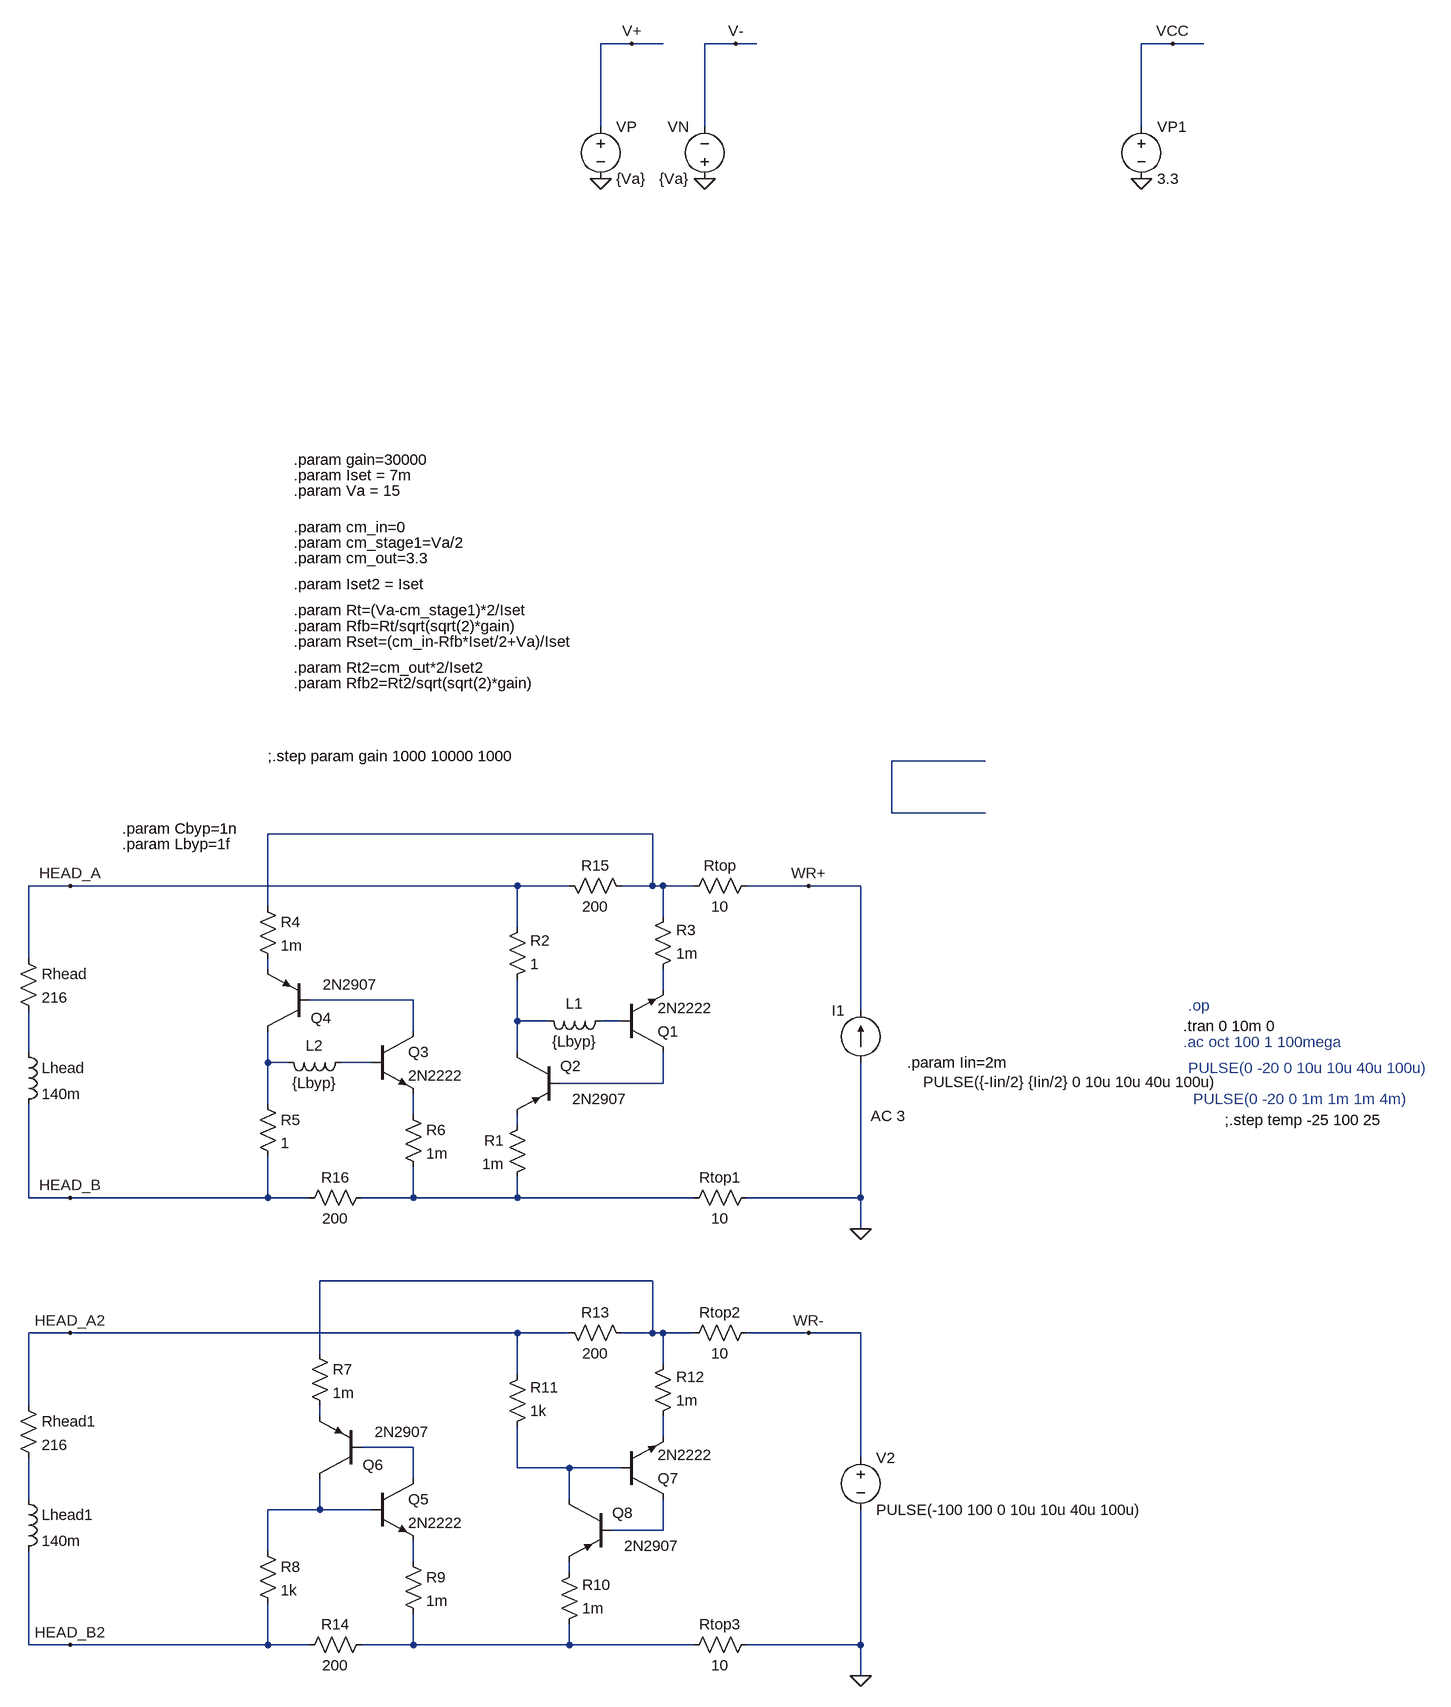
[diagram p0: schematic tape_record_amp1.asc]
tape_record_amp1.asc, the LTspice schematic file:
Version 4.1
SHEET 1 4868 2048
WIRE -224 -1328 -272 -1328
WIRE -176 -1328 -224 -1328
WIRE -64 -1328 -112 -1328
WIRE -32 -1328 -64 -1328
WIRE 608 -1328 560 -1328
WIRE 656 -1328 608 -1328
WIRE -272 -1200 -272 -1328
WIRE -112 -1200 -112 -1328
WIRE 560 -1200 560 -1328
WIRE 320 -224 176 -224
WIRE 176 -144 176 -224
WIRE 320 -144 176 -144
WIRE -192 -112 -784 -112
WIRE -1088 -32 -1152 -32
WIRE -400 -32 -1088 -32
WIRE -320 -32 -400 -32
WIRE -192 -32 -192 -112
WIRE -192 -32 -240 -32
WIRE -176 -32 -192 -32
WIRE -128 -32 -176 -32
WIRE 48 -32 -48 -32
WIRE 128 -32 48 -32
WIRE -784 0 -784 -112
WIRE -176 16 -176 -32
WIRE -400 32 -400 -32
WIRE -1152 80 -1152 -32
WIRE -784 96 -784 80
WIRE -176 128 -176 96
WIRE -560 144 -720 144
WIRE 128 160 128 -32
WIRE -400 176 -400 112
WIRE -352 176 -400 176
WIRE -240 176 -272 176
WIRE -560 192 -560 144
WIRE -1152 224 -1152 160
WIRE -400 224 -400 176
WIRE -784 240 -784 192
WIRE -752 240 -784 240
WIRE -624 240 -672 240
WIRE -176 272 -176 224
WIRE -176 272 -336 272
WIRE -784 304 -784 240
WIRE -560 320 -560 288
WIRE -400 336 -400 320
WIRE -1152 448 -1152 304
WIRE -1088 448 -1152 448
WIRE -784 448 -784 384
WIRE -784 448 -1088 448
WIRE -720 448 -784 448
WIRE -560 448 -560 400
WIRE -560 448 -640 448
WIRE -400 448 -400 416
WIRE -400 448 -560 448
WIRE -128 448 -400 448
WIRE 128 448 128 240
WIRE 128 448 -48 448
WIRE 128 496 128 448
WIRE -192 576 -704 576
WIRE -1088 656 -1152 656
WIRE -400 656 -1088 656
WIRE -320 656 -400 656
WIRE -192 656 -192 576
WIRE -192 656 -240 656
WIRE -176 656 -192 656
WIRE -128 656 -176 656
WIRE 48 656 -48 656
WIRE 128 656 48 656
WIRE -704 688 -704 576
WIRE -176 704 -176 656
WIRE -400 720 -400 656
WIRE -1152 768 -1152 656
WIRE -704 784 -704 768
WIRE -176 816 -176 784
WIRE -560 832 -640 832
WIRE 128 848 128 656
WIRE -400 864 -400 800
WIRE -320 864 -400 864
WIRE -240 864 -320 864
WIRE -560 880 -560 832
WIRE -1152 912 -1152 848
WIRE -320 912 -320 864
WIRE -704 928 -704 880
WIRE -704 928 -784 928
WIRE -624 928 -704 928
WIRE -176 960 -176 912
WIRE -176 960 -256 960
WIRE -784 992 -784 928
WIRE -560 1008 -560 976
WIRE -320 1024 -320 1008
WIRE -1152 1136 -1152 992
WIRE -1088 1136 -1152 1136
WIRE -784 1136 -784 1072
WIRE -784 1136 -1088 1136
WIRE -720 1136 -784 1136
WIRE -560 1136 -560 1088
WIRE -560 1136 -640 1136
WIRE -320 1136 -320 1104
WIRE -320 1136 -560 1136
WIRE -128 1136 -320 1136
WIRE 128 1136 128 928
WIRE 128 1136 -48 1136
WIRE 128 1184 128 1136
FLAG -272 -1120 0
FLAG -112 -1120 0
FLAG -224 -1328 V+
FLAG -64 -1328 V-
FLAG 560 -1120 0
FLAG 608 -1328 VCC
FLAG -1088 -32 HEAD_A
FLAG -1088 448 HEAD_B
FLAG 48 -32 WR+
FLAG 128 496 0
FLAG -1088 656 HEAD_A2
FLAG -1088 1136 HEAD_B2
FLAG 48 656 WR-
FLAG 128 1184 0
SYMBOL voltage -272 -1216 R0
SYMATTR InstName VP
SYMATTR Value {Va}
SYMBOL voltage -112 -1104 R180
WINDOW 0 24 96 Left 2
WINDOW 3 24 16 Left 2
SYMATTR InstName VN
SYMATTR Value {Va}
SYMBOL voltage 560 -1216 R0
SYMATTR InstName VP1
SYMATTR Value 3.3
SYMBOL current 128 240 R180
WINDOW 0 24 80 Left 2
WINDOW 3 -553 -30 Left 2
WINDOW 123 -69 -82 Left 2
WINDOW 39 0 0 Left 0
SYMATTR InstName I1
SYMATTR Value PULSE({-Iin/2} {Iin/2} 0 10u 10u 40u 100u)
SYMATTR Value2 AC 3
SYMBOL ind -1168 208 R0
SYMATTR InstName Lhead
SYMATTR Value 140m
SYMATTR SpiceLine Rser=1m
SYMBOL res -1168 64 R0
SYMATTR InstName Rhead
SYMATTR Value 216
SYMBOL res -32 -48 R90
WINDOW 0 0 56 VBottom 2
WINDOW 3 32 56 VTop 2
SYMATTR InstName Rtop
SYMATTR Value 10
SYMBOL res -144 464 R270
WINDOW 0 32 56 VTop 2
WINDOW 3 0 56 VBottom 2
SYMATTR InstName Rtop1
SYMATTR Value 10
SYMBOL ind -1168 896 R0
SYMATTR InstName Lhead1
SYMATTR Value 140m
SYMATTR SpiceLine Rser=1m
SYMBOL res -1168 752 R0
SYMATTR InstName Rhead1
SYMATTR Value 216
SYMBOL res -32 640 R90
WINDOW 0 0 56 VBottom 2
WINDOW 3 32 56 VTop 2
SYMATTR InstName Rtop2
SYMATTR Value 10
SYMBOL voltage 128 832 R0
WINDOW 123 0 0 Left 0
WINDOW 39 0 0 Left 0
SYMATTR InstName V2
SYMATTR Value PULSE(-100 100 0 10u 10u 40u 100u)
SYMBOL npn -240 912 M180
SYMATTR InstName Q7
SYMATTR Value 2N2222
SYMBOL pnp -256 912 M0
WINDOW 0 -34 21 Left 2
WINDOW 3 -105 72 Left 2
SYMATTR InstName Q8
SYMATTR Value 2N2907
SYMBOL res -336 1120 M180
WINDOW 0 36 76 Left 2
WINDOW 3 36 40 Left 2
SYMATTR InstName R10
SYMATTR Value 1m
SYMBOL res -416 816 M180
WINDOW 0 36 76 Left 2
WINDOW 3 36 40 Left 2
SYMATTR InstName R11
SYMATTR Value 1k
SYMBOL res -192 800 M180
WINDOW 0 36 76 Left 2
WINDOW 3 36 40 Left 2
SYMATTR InstName R12
SYMATTR Value 1m
SYMBOL res -32 1120 R90
WINDOW 0 0 56 VBottom 2
WINDOW 3 32 56 VTop 2
SYMATTR InstName Rtop3
SYMATTR Value 10
SYMBOL npn -624 880 R0
SYMATTR InstName Q5
SYMATTR Value 2N2222
SYMBOL pnp -640 880 R180
WINDOW 0 -34 21 Left 2
WINDOW 3 -105 72 Left 2
SYMATTR InstName Q6
SYMATTR Value 2N2907
SYMBOL res -720 672 R0
SYMATTR InstName R7
SYMATTR Value 1m
SYMBOL res -800 976 R0
SYMATTR InstName R8
SYMATTR Value 1k
SYMBOL res -576 992 R0
SYMATTR InstName R9
SYMATTR Value 1m
SYMBOL res -336 640 M90
WINDOW 0 0 56 VBottom 2
WINDOW 3 32 56 VTop 2
SYMATTR InstName R13
SYMATTR Value 200
SYMBOL res -624 1120 R90
WINDOW 0 0 56 VBottom 2
WINDOW 3 32 56 VTop 2
SYMATTR InstName R14
SYMATTR Value 200
SYMBOL npn -240 224 M180
SYMATTR InstName Q1
SYMATTR Value 2N2222
SYMBOL pnp -336 224 M0
WINDOW 0 -34 21 Left 2
WINDOW 3 -105 72 Left 2
SYMATTR InstName Q2
SYMATTR Value 2N2907
SYMBOL res -384 320 M0
SYMATTR InstName R1
SYMATTR Value 1m
SYMBOL res -416 128 M180
WINDOW 0 36 76 Left 2
WINDOW 3 36 40 Left 2
SYMATTR InstName R2
SYMATTR Value 1
SYMBOL res -192 112 M180
WINDOW 0 36 76 Left 2
WINDOW 3 36 40 Left 2
SYMATTR InstName R3
SYMATTR Value 1m
SYMBOL npn -624 192 R0
SYMATTR InstName Q3
SYMATTR Value 2N2222
SYMBOL pnp -720 192 R180
WINDOW 0 -34 21 Left 2
WINDOW 3 -105 72 Left 2
SYMATTR InstName Q4
SYMATTR Value 2N2907
SYMBOL res -800 -16 R0
SYMATTR InstName R4
SYMATTR Value 1m
SYMBOL res -800 288 R0
SYMATTR InstName R5
SYMATTR Value 1
SYMBOL res -576 304 R0
SYMATTR InstName R6
SYMATTR Value 1m
SYMBOL res -224 -16 M270
WINDOW 0 32 56 VTop 2
WINDOW 3 0 56 VBottom 2
SYMATTR InstName R15
SYMATTR Value 200
SYMBOL res -736 464 R270
WINDOW 0 32 56 VTop 2
WINDOW 3 0 56 VBottom 2
SYMATTR InstName R16
SYMATTR Value 200
SYMBOL ind -256 160 R90
WINDOW 0 5 56 VBottom 2
WINDOW 3 32 56 VTop 2
SYMATTR InstName L1
SYMATTR Value {Lbyp}
SYMATTR SpiceLine Rser=1m
SYMBOL ind -656 224 R90
WINDOW 0 5 56 VBottom 2
WINDOW 3 32 56 VTop 2
SYMATTR InstName L2
SYMATTR Value {Lbyp}
SYMATTR SpiceLine Rser=1m
TEXT 688 328 Left 2 !;.step temp -25 100 25
TEXT 624 208 Left 2 ;.ac oct 100 1 100mega
TEXT 624 184 Left 2 !.tran 0 10m 0
TEXT 200 240 Left 2 !.param Iin=2m
TEXT -744 -432 Left 2 !.param Rfb=Rt/sqrt(sqrt(2)*gain)
TEXT -744 -456 Left 2 !.param Rt=(Va-cm_stage1)*2/Iset
TEXT -744 -584 Left 2 !.param cm_in=0
TEXT -744 -496 Left 2 !.param Iset2 = Iset
TEXT -744 -368 Left 2 !.param Rt2=cm_out*2/Iset2
TEXT -744 -344 Left 2 !.param Rfb2=Rt2/sqrt(sqrt(2)*gain)
TEXT -744 -536 Left 2 !.param cm_out=3.3
TEXT -744 -560 Left 2 !.param cm_stage1=Va/2
TEXT -744 -408 Left 2 !.param Rset=(cm_in-Rfb*Iset/2+Va)/Iset
TEXT -744 -664 Left 2 !.param Iset = 7m
TEXT -744 -640 Left 2 !.param Va = 15
TEXT -744 -688 Left 2 !.param gain=30000
TEXT 632 152 Left 2 ;.op
TEXT -784 -232 Left 2 !;.step param gain 1000 10000 1000
TEXT 640 296 Left 2 ;PULSE(0 -20 0 1m 1m 1m 4m)
TEXT 632 248 Left 2 ;PULSE(0 -20 0 10u 10u 40u 100u)
TEXT -1008 -96 Left 2 !.param Lbyp=1f
TEXT -1008 -120 Left 2 !.param Cbyp=1n

The netlist it stands for:
* tape_record_amp1.asc
VP V+ 0 {Va}
VN 0 V- {Va}
VP1 VCC 0 3.3
I1 0 WR+ PULSE({-Iin/2} {Iin/2} 0 10u 10u 40u 100u) AC 3
Lhead N008 HEAD_B 140m Rser=1m
Rhead HEAD_A N008 216
Rtop WR+ N002 10
Rtop1 N014 0 10
Lhead1 N020 HEAD_B2 140m Rser=1m
Rhead1 HEAD_A2 N020 216
Rtop2 WR- N015 10
V2 WR- 0 PULSE(-100 100 0 10u 10u 40u 100u)
Q7 N022 N019 N017 0 2N2222
Q8 N019 N022 N024 0 2N2907
R10 N025 N024 1m
R11 N019 HEAD_A2 1k
R12 N017 N015 1m
Rtop3 0 N025 10
Q5 N018 N021 N023 0 2N2222
Q6 N021 N018 N016 0 2N2907
R7 N015 N016 1m
R8 N021 HEAD_B2 1k
R9 N023 N025 1m
R13 HEAD_A2 N015 200
R14 N025 HEAD_B2 200
Q1 N011 N007 N004 0 2N2222
Q2 N006 N011 N013 0 2N2907
R1 N013 N014 1m
R2 N006 HEAD_A 1
R3 N004 N002 1m
Q3 N005 N010 N012 0 2N2222
Q4 N009 N005 N003 0 2N2907
R4 N002 N003 1m
R5 N009 HEAD_B 1
R6 N012 N014 1m
R15 N002 HEAD_A 200
R16 HEAD_B N014 200
L1 N007 N006 {Lbyp} Rser=1m
L2 N010 N009 {Lbyp} Rser=1m
.model NPN NPN
.model PNP PNP
.lib standard.bjt
;.step temp -25 100 25
* .ac oct 100 1 100mega
.tran 0 10m 0
.param Iin=2m
.param Rfb=Rt/sqrt(sqrt(2)*gain)
.param Rt=(Va-cm_stage1)*2/Iset
.param cm_in=0
.param Iset2 = Iset
.param Rt2=cm_out*2/Iset2
.param Rfb2=Rt2/sqrt(sqrt(2)*gain)
.param cm_out=3.3
.param cm_stage1=Va/2
.param Rset=(cm_in-Rfb*Iset/2+Va)/Iset
.param Iset = 7m
.param Va = 15
.param gain=30000
* .op
;.step param gain 1000 10000 1000
* PULSE(0 -20 0 1m 1m 1m 4m)
* PULSE(0 -20 0 10u 10u 40u 100u)
.param Lbyp=1f
.param Cbyp=1n
.backanno
.end